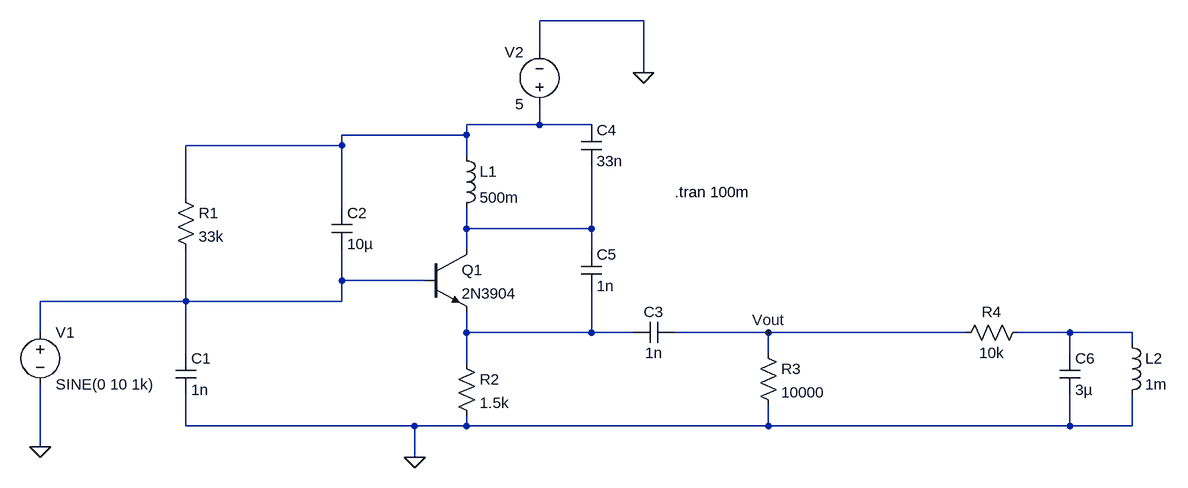
[diagram p0: schematic Modulator.asc]
Modulator.asc, the LTspice schematic file:
Version 4
SHEET 1 1724 680
WIRE 880 -272 720 -272
WIRE 720 -224 720 -272
WIRE 880 -192 880 -272
WIRE 720 -112 720 -144
WIRE 720 -112 608 -112
WIRE 800 -112 720 -112
WIRE 608 -96 608 -112
WIRE 608 -96 416 -96
WIRE 416 -80 416 -96
WIRE 416 -80 176 -80
WIRE 608 -64 608 -96
WIRE 176 0 176 -80
WIRE 416 16 416 -80
WIRE 608 48 608 16
WIRE 800 48 800 -48
WIRE 800 48 608 48
WIRE 608 80 608 48
WIRE 800 80 800 48
WIRE 416 128 416 80
WIRE 544 128 416 128
WIRE 176 160 176 80
WIRE 176 160 -48 160
WIRE 416 160 416 128
WIRE 416 160 176 160
WIRE -48 208 -48 160
WIRE 608 208 608 176
WIRE 800 208 800 144
WIRE 800 208 608 208
WIRE 864 208 800 208
WIRE 1072 208 928 208
WIRE 1376 208 1072 208
WIRE 1536 208 1456 208
WIRE 1632 208 1536 208
WIRE 1632 224 1632 208
WIRE 176 240 176 160
WIRE 1072 240 1072 208
WIRE 1536 240 1536 208
WIRE 608 256 608 208
WIRE 176 352 176 304
WIRE 528 352 176 352
WIRE 608 352 608 336
WIRE 608 352 528 352
WIRE 1072 352 1072 320
WIRE 1072 352 608 352
WIRE 1536 352 1536 304
WIRE 1536 352 1072 352
WIRE 1632 352 1632 304
WIRE 1632 352 1536 352
WIRE -48 384 -48 288
WIRE 528 400 528 352
FLAG 528 400 0
FLAG -48 384 0
FLAG 880 -192 0
FLAG 1072 208 Vout
DATAFLAG 1600 208 ""
SYMBOL voltage -48 192 R0
WINDOW 123 0 0 Left 0
WINDOW 39 0 0 Left 0
SYMATTR InstName V1
SYMATTR Value SINE(0 10 1k)
SYMBOL res 160 -16 R0
SYMATTR InstName R1
SYMATTR Value 33k
SYMBOL cap 160 240 R0
SYMATTR InstName C1
SYMATTR Value 1n
SYMBOL cap 400 16 R0
SYMATTR InstName C2
SYMATTR Value 10µ
SYMBOL ind 592 -80 R0
SYMATTR InstName L1
SYMATTR Value 500m
SYMBOL res 592 240 R0
SYMATTR InstName R2
SYMATTR Value 1.5k
SYMBOL cap 928 192 R90
WINDOW 0 0 32 VBottom 2
WINDOW 3 32 32 VTop 2
SYMATTR InstName C3
SYMATTR Value 1n
SYMBOL res 1056 224 R0
SYMATTR InstName R3
SYMATTR Value 10000
SYMBOL cap 784 -112 R0
SYMATTR InstName C4
SYMATTR Value 33n
SYMBOL cap 784 80 R0
SYMATTR InstName C5
SYMATTR Value 1n
SYMBOL npn 544 80 R0
SYMATTR InstName Q1
SYMATTR Value 2N3904
SYMBOL voltage 720 -128 R180
WINDOW 0 24 96 Left 2
WINDOW 3 24 16 Left 2
WINDOW 123 0 0 Left 0
WINDOW 39 0 0 Left 0
SYMATTR InstName V2
SYMATTR Value 5
SYMBOL res 1472 192 R90
WINDOW 0 0 56 VBottom 2
WINDOW 3 32 56 VTop 2
SYMATTR InstName R4
SYMATTR Value 10k
SYMBOL cap 1520 240 R0
SYMATTR InstName C6
SYMATTR Value 3µ
SYMBOL ind 1616 208 R0
SYMATTR InstName L2
SYMATTR Value 1m
TEXT 928 -8 Left 2 !.tran 100m

The netlist it stands for:
* Modulator.asc
V1 N003 0 SINE(0 10 1k)
R1 N001 N003 33k
C1 N003 0 1n
C2 N001 N003 10µ
L1 N001 N002 500m
R2 N004 0 1.5k
C3 Vout N004 1n
R3 Vout 0 10000
C4 N001 N002 33n
C5 N002 N004 1n
Q1 N002 N003 N004 0 2N3904
V2 N001 0 5
R4 N005 Vout 10k
C6 N005 0 3µ
L2 N005 0 1m
.model NPN NPN
.model PNP PNP
.lib standard.bjt
.tran 100m
.backanno
.end